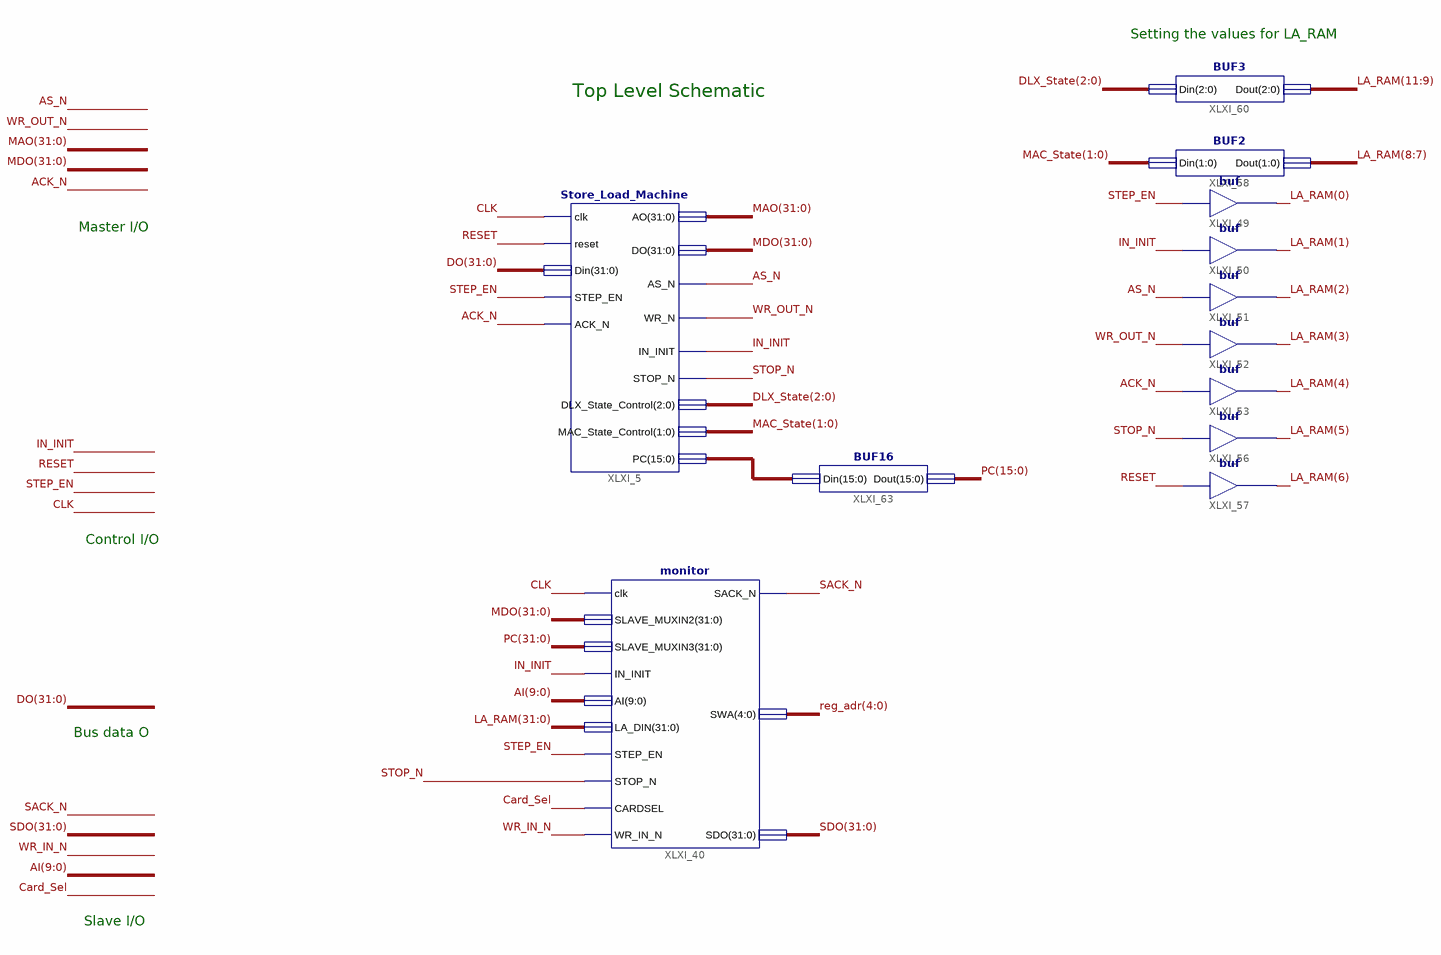
[diagram p0: schematic sheet 1]
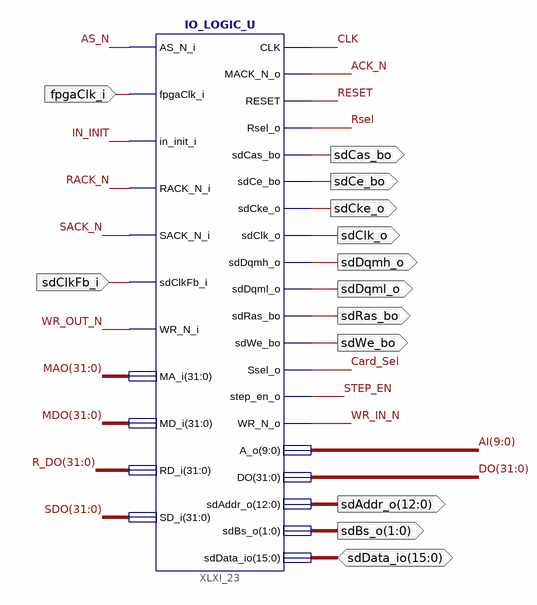
[diagram p1: schematic sheet 2]
// Xilinx ISE schematic Top_Level.sch (spartan6) as structural Verilog: 13 symbols, 13 ports
module Top_Level (
  input  fpgaClk_i,
  input  sdClkFb_i,
  inout  [15:0] sdData_io,
  output sdClk_o,
  output [1:0] sdBs_o,
  output sdDqml_o,
  output sdDqmh_o,
  output sdWe_bo,
  output sdCas_bo,
  output sdRas_bo,
  output sdCe_bo,
  output sdCke_o,
  output [12:0] sdAddr_o
);

  wire ACK_N, AS_N, Card_Sel, CLK, IN_INIT, RACK_N, RESET, Rsel, SACK_N, STEP_EN, STOP_N, WR_IN_N, WR_OUT_N;
  wire [1:0] MAC_State;
  wire [2:0] DLX_State;
  wire [4:0] reg_adr;
  wire [9:0] AI;
  wire [15:0] XLXN_33;
  wire [31:0] DO, LA_RAM, MAO, MDO, PC, R_DO, SDO;

  IO_LOGIC_U XLXI_23 (
    .AS_N_i(AS_N), .fpgaClk_i(fpgaClk_i), .in_init_i(IN_INIT), .RACK_N_i(RACK_N), .SACK_N_i(SACK_N),
    .sdClkFb_i(sdClkFb_i), .WR_N_i(WR_OUT_N), .MA_i(MAO), .MD_i(MDO), .RD_i(R_DO), .SD_i(SDO), .CLK(CLK),
    .MACK_N_o(ACK_N), .RESET(RESET), .Rsel_o(Rsel), .sdCas_bo(sdCas_bo), .sdCe_bo(sdCe_bo),
    .sdCke_o(sdCke_o), .sdClk_o(sdClk_o), .sdDqmh_o(sdDqmh_o), .sdDqml_o(sdDqml_o), .sdRas_bo(sdRas_bo),
    .sdWe_bo(sdWe_bo), .Ssel_o(Card_Sel), .step_en_o(STEP_EN), .WR_N_o(WR_IN_N), .A_o(AI), .DO(DO),
    .sdAddr_o(sdAddr_o), .sdBs_o(sdBs_o), .sdData_io(sdData_io));
  buf XLXI_49 (LA_RAM[0], STEP_EN);
  buf XLXI_50 (LA_RAM[1], IN_INIT);
  buf XLXI_51 (LA_RAM[2], AS_N);
  buf XLXI_52 (LA_RAM[3], WR_OUT_N);
  buf XLXI_53 (LA_RAM[4], ACK_N);
  buf XLXI_56 (LA_RAM[5], STOP_N);
  buf XLXI_57 (LA_RAM[6], RESET);
  BUF2 XLXI_58 (.Din(MAC_State), .Dout(LA_RAM[8:7]));
  BUF3 XLXI_60 (.Din(DLX_State), .Dout(LA_RAM[11:9]));
  monitor XLXI_40 (
    .clk(CLK), .SLAVE_MUXIN2(MDO), .SLAVE_MUXIN3(PC), .IN_INIT(IN_INIT), .AI(AI), .LA_DIN(LA_RAM),
    .STEP_EN(STEP_EN), .STOP_N(STOP_N), .CARDSEL(Card_Sel), .WR_IN_N(WR_IN_N), .SACK_N(SACK_N),
    .SWA(reg_adr), .SDO(SDO));
  BUF16 XLXI_63 (.Din(XLXN_33), .Dout(PC[15:0]));
  Store_Load_Machine XLXI_5 (
    .clk(CLK), .reset(RESET), .Din(DO), .STEP_EN(STEP_EN), .ACK_N(ACK_N), .AO(MAO), .DO(MDO), .AS_N(AS_N),
    .WR_N(WR_OUT_N), .DLX_State_Control(DLX_State), .MAC_State_Control(MAC_State), .IN_INIT(IN_INIT),
    .STOP_N(STOP_N), .PC(XLXN_33));

  // Notes on the sheet:
  //   Setting the values for LA_RAM
  //   Top Level Schematic
  //   Master I/O
  //   Control I/O
  //   Bus data O
  //   Slave I/O
endmodule
